# EAGLE design untitled (EAGLE 9.6.2)
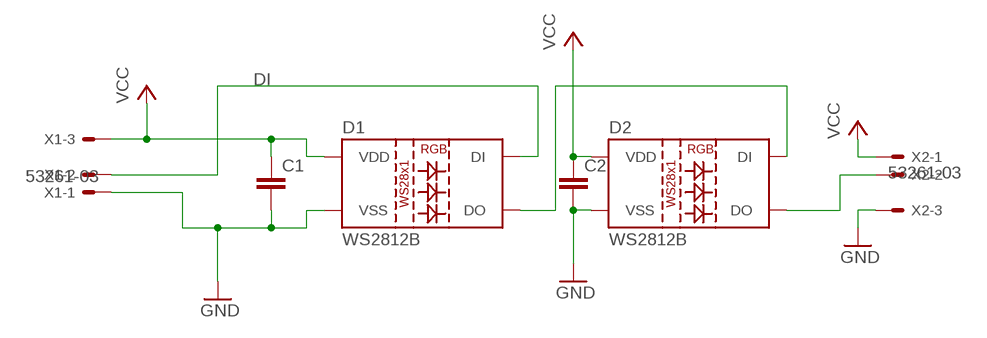
[diagram p0: schematic, sheet 1]

## Parts
C1  C-EUC0603  [C0603]
C2  C-EUC0603  [C0603]
D1  WS2812B  [WS2812B]
D2  WS2812B  [WS2812B]
X1  53261-03  [53261-03]
X2  53261-03  [53261-03]

## Nets
DI: D1.4(DI) X1.2
GND: C1.2 C2.2 D1.3(VSS) D2.3(VSS) X1.1 X2.3
N$3: D2.2(DO) X2.2
N$4: D1.2(DO) D2.4(DI)
VCC: C1.1 C2.1 D1.1(VDD) D2.1(VDD) X1.3 X2.1

## Library data of the parts
C1 C2 = rcl:C-EU: CAPACITOR, European symbol; SPICEPREFIX: C
D1 D2 = SparkFun-LED:WS2812B: WS2812B SMD addressable RGB LED 5x5mm SMD LED with built-in controller IC. Color: Red/Green/Blue mC Rating: RGB: 390, 660, 180 mcd Forward Voltage: RGB: 2.0, 3.0, 3.0 V Packages:WS2812B SparkFun Products: Blynk Board - ESP8266 <https://www.sparkfun.com/products/13794>; PROD_ID: DIO-12503
X1 X2 = con-molex:53?-03: CONNECTOR wire to board 1.25 mm (.049 inch) pitch header; MF: MOLEX; MPN: 53261-0390; OC_FARNELL: 1125359; OC_NEWARK: 57H5006

## Board
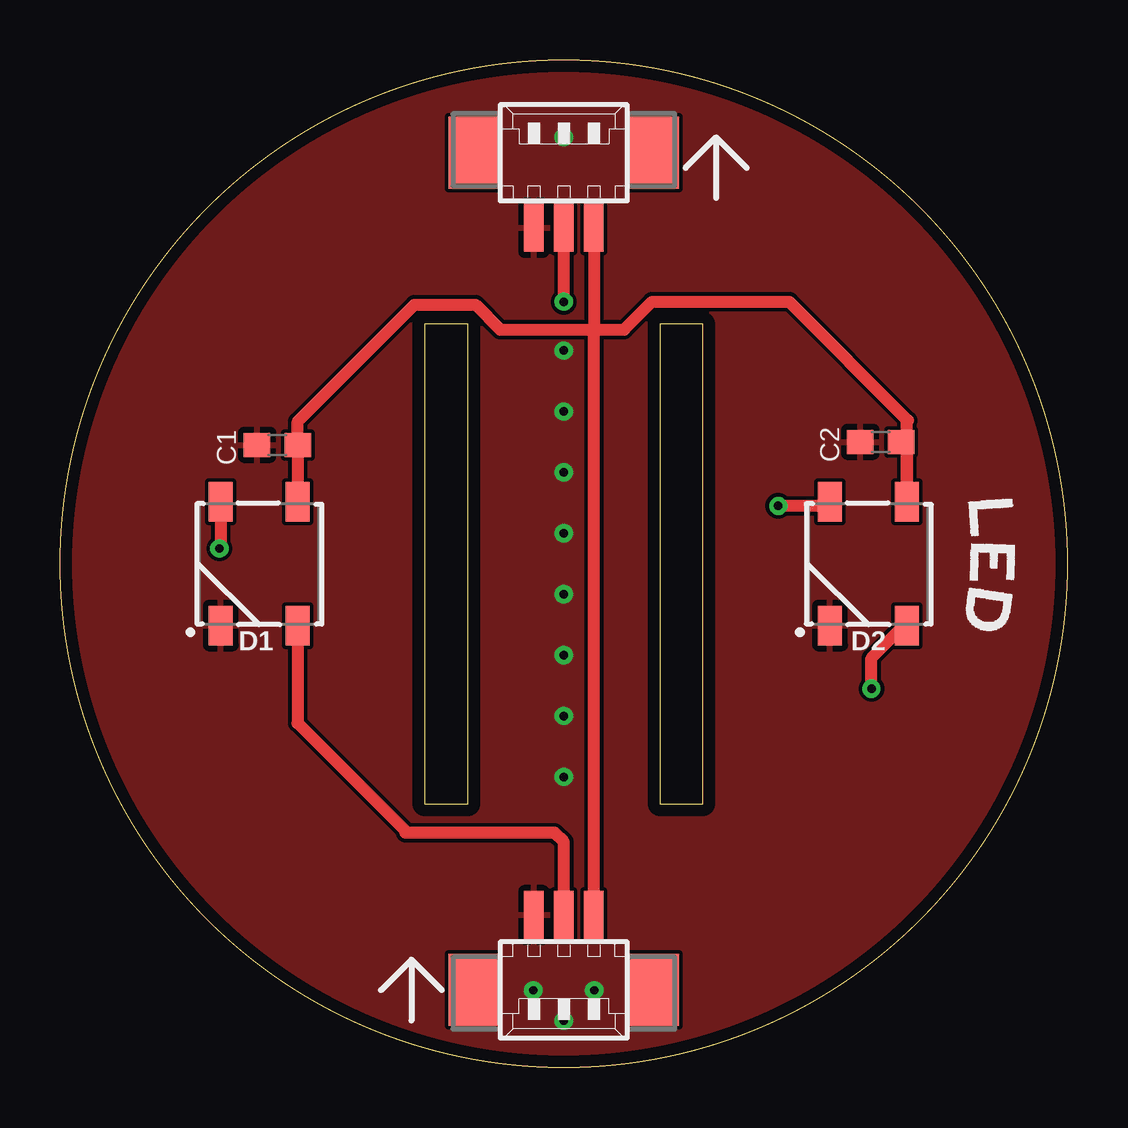
[diagram p1: board, top side]
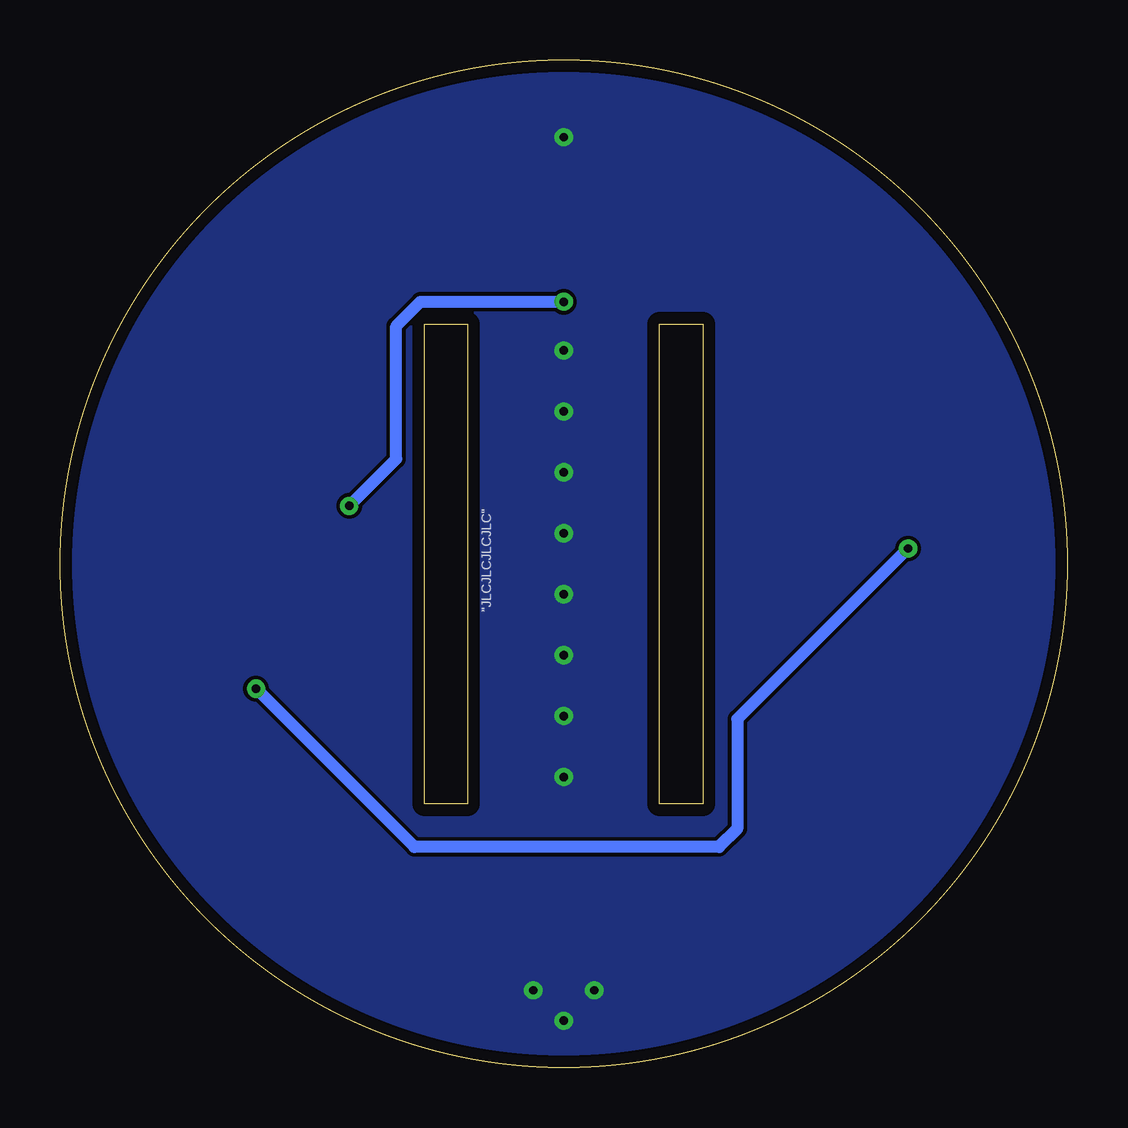
[diagram p2: board, bottom side, seen from below]

Size 42 x 42 mm. Coordinates in mm from the lower left corner, seen from the top.
Outline: 17,31 15.21,31 15.21,11 17,11 17,31
Outline: 26.8,31 25,31 25,11 26.8,11 26.8,31
Outline: circle at 21,21 radius 21
Copper layers (1*16): Top 0.035mm / dielectric 1.5mm / Bottom 0.035mm
Design rules "default *": minimum track width 6mil, minimum drill 0.35mm, track to track 6mil, track to pad 6mil, pad to pad 6mil, via to via 6mil, smd to smd 6mil, copper to edge 20mil, drill to drill 6mil, minimum pad ring 10mil, minimum via ring 8mil, stop-mask expansion 4mil, vias tented up to drill 20mil, thermal gap 10mil

### Footprints (pad centres in the part's own frame; a part is rotated, then mirrored left to right if it is on the bottom)
C0603 = smd 1.1 x 1: 1 -0.85,0; 2 0.85,0
WS2812B = smd 1.651 x 1: 1 2.577,-1.6; 2 2.577,1.6; 3 -2.577,1.6; 4 -2.577,-1.6
53261-03 = smd 0.8 x 2: 1 1.25,-2.5; 2 0,-2.5; 3 -1.25,-2.5 | smd 2.1 x 3: S1 3.75,0.625; S2 -3.75,0.625

### Placement (x,y rotation side)
C1  9.06,25.95 180 top
C2  34.21,26.08 180 top
D1  8.3,21 90 top
D2  33.7,21 90 top
X1  21,3.86 180 top
X2  21,37.51 0 top

### Tracks (layer width: path | path; a pad name or v marks a point on that pad's centre or on a via)
DI
  Top 0.508: X1.2 21,9.4 20.62,9.78 14.4,9.78 14.4,9.86 9.9,14.36 D1.4
GND  (via drill 0.35)
  other vias: 21,1.95 19.73,3.22 22.27,3.22 21,38.78 21,12.11 21,14.65 21,17.19 21,19.73 21,22.27 21,24.81 21,27.35 21,29.89
  pour Top: -0.59,-0.59 42.59,-0.59 42.59,42.59 -0.59,42.59
  pour Bottom: -0.59,-0.59 42.59,-0.59 42.59,42.59 -0.59,42.59
N$3  (via drill 0.35)
  Top 0.508: D2.2 31.94,23.41 v29.94,23.41 | v21,31.92 X2.2
  Bottom 0.508: v29.94,23.41 27.98,25.37 27.98,30.91 26.97,31.92 v21,31.92
N$4  (via drill 0.35)
  Top 0.508: D1.2 6.7,21.69 v6.65,21.64 | v33.83,15.79 33.83,17.06 35.19,18.42 D2.4
  Bottom 0.508: v6.65,21.64 13.76,14.52 13.76,9.95 14.52,9.19 27.22,9.19 v33.83,15.79
VCC
  Top 0.508: D1.1 9.91,23.59 C1.1 9.91,26.93 14.78,31.8 17.32,31.8 18.35,30.76 22.25,30.76 | 35.35,23.63 D2.1 | D2.1 35.24,23.64 35.31,23.72 35.31,25.83 C2.1 | X1.3 22.25,30.76 | 22.25,30.76 22.27,30.78 | X2.1 22.25,30.76 | 22.25,30.76 23.52,30.76 24.68,31.92 30.4,31.92 35.35,26.97 35.3,26.92 D2.1

### Text on the board
bPlace: "JLCJLCJLCJLC"